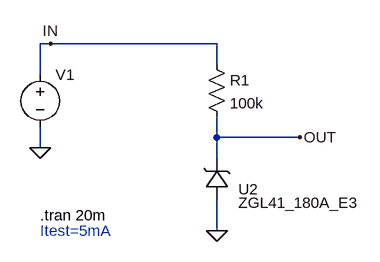
[diagram p0: schematic ZGL41_180A_E3.asc]
ZGL41_180A_E3.asc, the LTspice schematic file:
Version 4.1
SHEET 1 880 680
WIRE 0 32 -16 32
WIRE 256 32 0 32
WIRE 256 64 256 32
WIRE -16 80 -16 32
WIRE 256 176 256 144
WIRE 384 176 256 176
WIRE -16 192 -16 160
WIRE 256 208 256 176
WIRE 256 320 256 272
FLAG -16 192 0
FLAG 256 320 0
FLAG 384 176 OUT
FLAG 0 32 IN
SYMBOL voltage -16 64 R0
WINDOW 3 41 64 Invisible 2
WINDOW 123 0 0 Left 0
WINDOW 39 0 0 Left 0
SYMATTR Value SINE({680/2} {680/2} 50)
SYMATTR InstName V1
SYMBOL res 240 48 R0
SYMATTR InstName R1
SYMATTR Value 100k
SYMBOL MyLib\\Diode_Zener\\ZGL41_180A_E3 240 272 M180
WINDOW 38 49 -5 Left 2
SYMATTR InstName U2
TEXT -16 296 Left 2 !.tran 20m
TEXT -16 320 Left 2 ;Itest=5mA

The netlist it stands for:
* ZGL41_180A_E3.asc
V1 IN 0 SINE({680/2} {680/2} 50)
R1 IN OUT 100k
X§U2 0 OUT ZGL41_180A_E3  ; pins + -
.tran 20m
* Itest=5mA
.lib MyLib/Diode_Zener/ZGL41_180A_E3.lib
.backanno
.end